# Altium project UKU20710_FACE_DWIN.PrjPCB
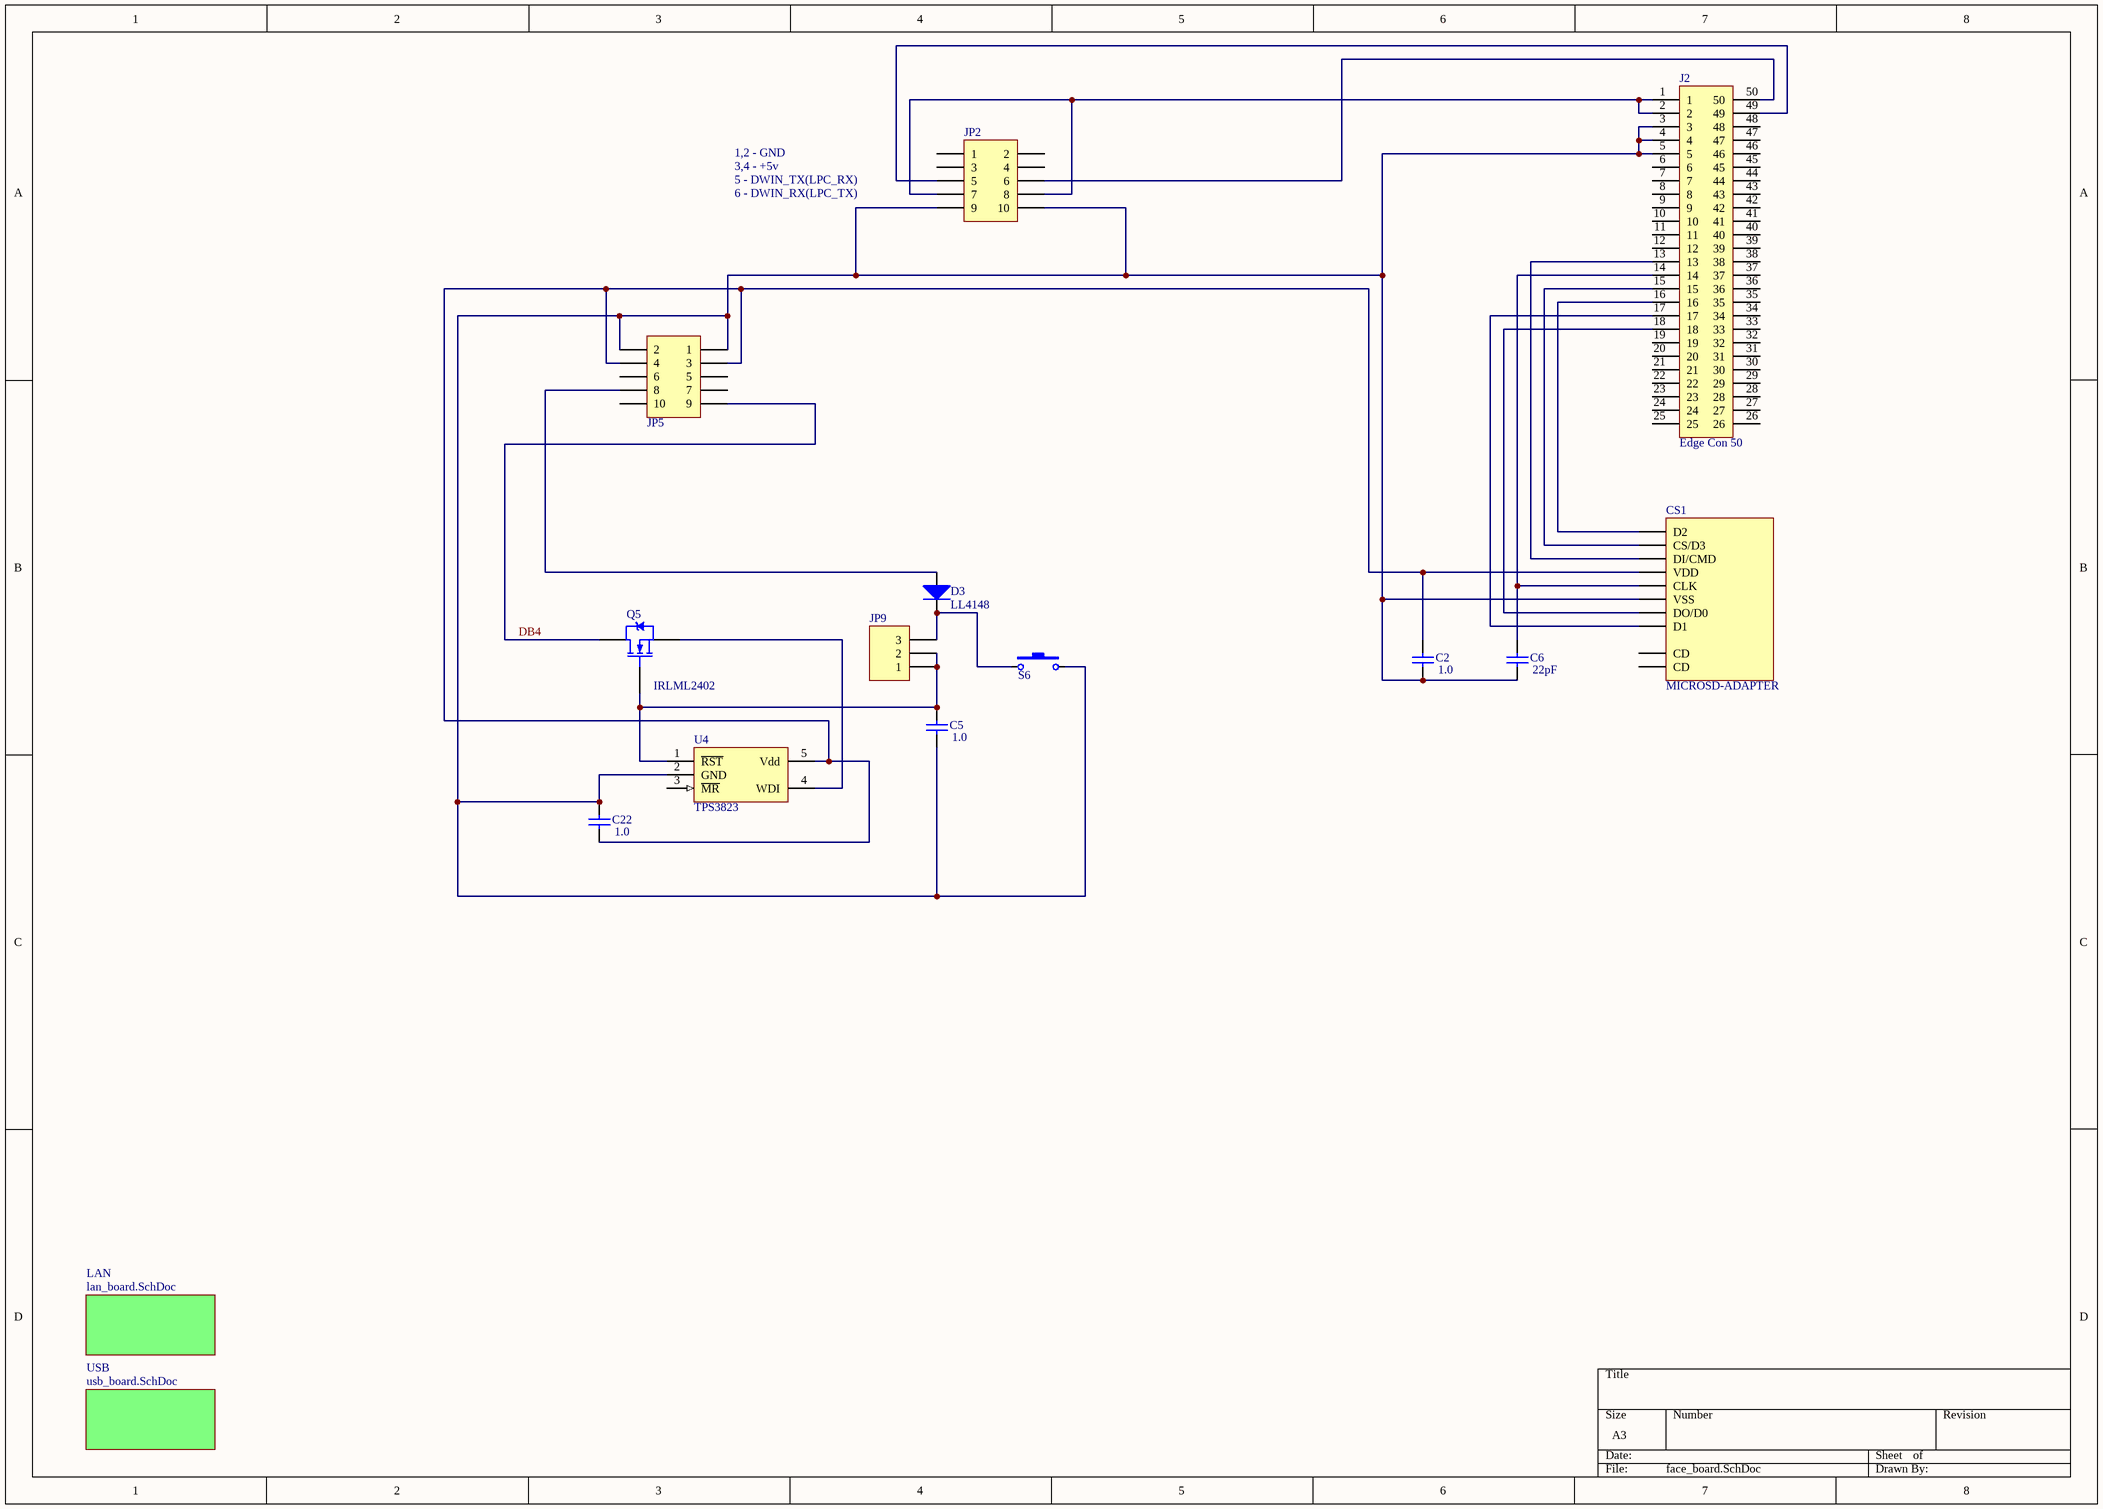
[diagram p0: face_board.SchDoc]
3 sheets, 59 parts. Net scope: global (net labels, ports and power ports of the same name join across sheets).
Board file: uku20710_face.PcbDoc
Sheets:
  face_board.SchDoc
    USB = usb_board.SchDoc
    LAN = lan_board.SchDoc

## Sheet face_board.SchDoc
size A3

### Parts
C2  1.0  [_0603]
C5  1.0  [_0603]
C6  22pF  [_0603]
C22  1.0  [_0603]
CS1  MICROSD-ADAPTER  [microsd_2]
D3  LL4148  [_1206d]
J2  Edge Con 50  [FH12-50]
JP2  PBD-10  [HDR2X5]  (value not drawn)
JP5  PLHD-20  [HDR2X5]  (value not drawn)
JP9  PLS-3  [HDR1X3]  (value not drawn)
Q5  IRLML2402  [SO-G3]
S6  SWT-6  [SWT-6]  (value not drawn)
U4  TPS3823  [SO-G5/P.95]

### Sub-sheets
LAN = lan_board.SchDoc: no entries
USB = usb_board.SchDoc: no entries

### Nets
DB4: JP5.9 Q5.3(D)
NetC2_1: C2.1 C5.1 C6.1 C22.2 CS1.6(VSS) J2.3 J2.4 J2.5 JP2.9 JP2.10 JP5.1 JP5.2 S6.2 U4.2(GND)
NetC2_2: C2.2 C22.1 CS1.4(VDD) JP5.3 JP5.4 U4.5(Vdd)
NetC5_2: C5.2 JP9.1 JP9.2 Q5.1(G) U4.1(~{RST})
NetC6_2: C6.2 CS1.5(CLK) J2.14
NetCS1_1: CS1.1(D2) J2.16
NetCS1_2: CS1.2(CS/D3) J2.15
NetCS1_3: CS1.3(DI/CMD) J2.13
NetCS1_7: CS1.7(DO/D0) J2.18
NetCS1_8: CS1.8(D1) J2.17
NetD3_1: D3.1(A) JP5.8
NetD3_2: D3.2(K) JP9.3 S6.1
NetJ2_1: J2.1 J2.2 JP2.7 JP2.8
NetJ2_49: J2.49 JP2.5
NetJ2_50: J2.50 JP2.6
NetQ5_2: Q5.2(S) U4.4(WDI)

Not connected (* = marked no-connect by the designer): CS1 9(CD) 10(CD); J2 6 7 8 9 10 11 12 19 20 21 22 23 24 25 26 27 28 29 30 31 32 33 34 35 36 37 38 39 40 41 42 43 44 45 46 47 48; JP2 1 2 3 4; JP5 5 6 7 10; U4 3(~{MR})

### Notes on the sheet
- 1,2 - GND
- 3,4 - +5v
- 5 - DWIN_TX(LPC_RX)
- 6 - DWIN_RX(LPC_TX)

### Library data of the parts
C2 C5 C22 = Cap Semi: Capacitor; Manufacturer: Generic Components; Class I: Passive; Value: 0,1; Published: 8-Jun-2000; Revision: July-2002: Re-released for DXP Platform.; Publisher: Altium Limited; Class II: Capacitor
C6 = Cap Semi: Capacitor; Manufacturer: Generic Components; Class I: Passive; Published: 8-Jun-2000; Revision: July-2002: Re-released for DXP Platform.; Publisher: Altium Limited; Class II: Capacitor; Value: 22pF
D3 = Diode: Manufacturer: Generic Components; Class I: Discrete; Class II: Diode - Switching; Published: 8-Jun-2000; Revision: July-2002: Re-released for DXP Platform.; Publisher: Altium Limited; Value: LL4148
J2 = Edge Con 50: 50-Pin Edge Connector; Manufacturer: Generic Components; Revision: July-2002: Re-released for DXP Platform.; Publisher: Altium Limited; Class I: Connector
JP2 JP5 = Header 5X2: Header, 5-Pin, Dual row; Manufacturer: Generic Components; Class I: Connector; Revision: July-2002: Re-released for DXP Platform.; Publisher: Altium Limited
JP9 = Header 3: Header, 3-Pin; Manufacturer: Generic Components; Class I: Connector; Revision: July-2002: Re-released for DXP Platform.; Publisher: Altium Limited
Q5 = IRLML2402: HEXFET Power MOSFET; Manufacturer: International Rectifier; Class I: Discrete; Class II: MOSFET - Power; Published: 8-Jun-2000; Revision: July-2002: Re-released for DXP Platform.; Datasheet: Latest Revision: Aug-1997; Package Reference: SOT-23; Publisher: Altium Limited; Value: IRLML2402
S6 = SWT-9: Button; Manufacturer: Generic Components; Published: 24-Mar-1999; Revision: July-2002: Re-released for DXP Platform.; Publisher: Altium Limited; Value: SWT-6
U4 = TPS3823: Reset IC; Manufacturer: National Semiconductor; Package Information: Latest Revision: Aug-1999; Class I: Power Management; Class II: Voltage Regulator; Value: TPS76333; Published: 15-Apr-2002; Datasheet: Latest Revision: Oct-1999; Package Reference: MA05B; Publisher: Altium Limited

## Sheet usb_board.SchDoc
size A4
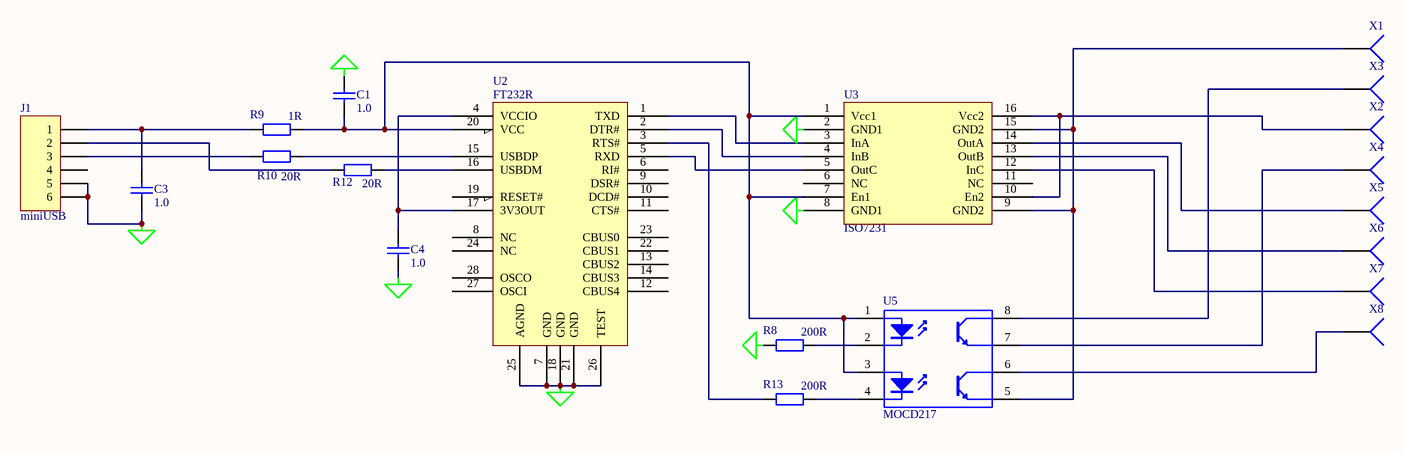
[diagram p1: usb_board.SchDoc]

### Parts
C1  1.0  [_0603]
C3  1.0  [_0603]
C4  1.0  [_0603]
J1  miniUSB  [USBmini]
R8  200R  [_0603]
R9  1R  [_0603]
R10  20R  [_0603]
R12  20R  [_0603]
R13  200R  [_0603]
U2  FT232R  [SOP65P780-28L]
U3  ISO7231
U5  MOCD217  [SO-G8]
X1  (no value)  [PIN1]
X2  (no value)  [PIN1]
X3  (no value)  [PIN1]
X4  (no value)  [PIN1]
X5  (no value)  [PIN1]
X6  (no value)  [PIN1]
X7  (no value)  [PIN1]
X8  (no value)  [PIN1]

### Nets
GND_USB: C1.1 C3.1 C4.1 J1.5 J1.6 R8.1 U2.7(GND) U2.18(GND) U2.21(GND) U2.25(AGND) U2.26(TEST) U3.2(GND1) U3.8(GND1)
NetC1_2: C1.2 R9.2 U2.20(VCC) U3.1(Vcc1) U3.7(En1) U5.1(A) U5.3(A)
NetC3_2: C3.2 J1.1 R9.1
NetC4_2: C4.2 U2.4(VCCIO) U2.17(3V3OUT)
NetJ1_2: J1.2 R12.1
NetJ1_3: J1.3 R10.1
NetR8_2: R8.2 U5.2(K)
NetR10_2: R10.2 U2.15(USBDP)
NetR12_2: R12.2 U2.16(USBDM)
NetR13_1: R13.1 U2.3(RTS#)
NetR13_2: R13.2 U5.4(K)
NetU2_1: U2.1(TXD) U3.3(InA)
NetU2_2: U2.2(DTR#) U3.4(InB)
NetU2_5: U2.5(RXD) U3.5(OutC)
NetU3_9: U3.9(GND2) U3.15(GND2) U5.5(E) X1.1
NetU3_10: U3.10(En2) U3.16(Vcc2) X2.1
NetU3_12: U3.12(InC) X7.1
NetU3_13: U3.13(OutB) X6.1
NetU3_14: U3.14(OutA) X5.1
NetU5_6: U5.6(C) X8.1
NetU5_7: U5.7(E) X4.1
NetU5_8: U5.8(C) X3.1

Not connected (* = marked no-connect by the designer): J1 4; U2 6(RI#) 8(NC) 9(DSR#) 10(DCD#) 11(CTS#) 12(CBUS4) 13(CBUS2) 14(CBUS3) 19(RESET#) 22(CBUS1) 23(CBUS0) 24(NC) 27(OSCI) 28(OSCO); U3 6(NC) 11(NC)

### Library data of the parts
C1 C3 C4 = Cap Semi: Capacitor (Semiconductor SIM Model); Manufacturer: Generic Components; Class I: Passive; Value: 1,0; Published: 8-Jun-2000; Revision: July-2002: Re-released for DXP Platform.; Publisher: Altium Limited; Class II: Capacitor
J1 = Header 6: Header, 6-Pin; Value: USB-B; LatestRevisionDate: 17-Jul-2002; LatestRevisionNote: Re-released for DXP Platform.; Publisher: Altium Limited
R8-R10 R12 R13 = RES: Body: 0603; Value: 22R; Type: S; Pins: 2
U2 = FT232R: Body: SSOP28LD; Value: FT232RL; Type: S; Pins: 20
U5 = MOCD217: Optic; Value: MOCD217
X1-X8 = Socket: Manufacturer: Generic Components; Class I: Connector; Revision: July-2002: Re-released for DXP Platform.; Publisher: Altium Limited

## Sheet lan_board.SchDoc
size A4
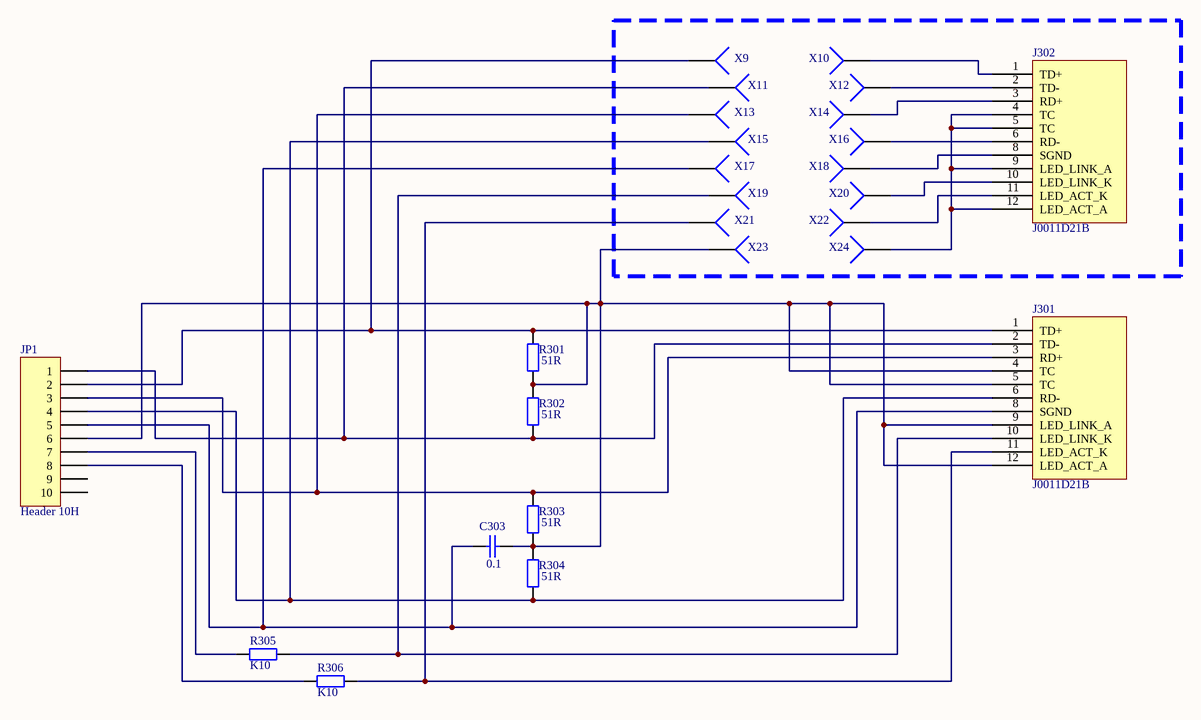
[diagram p2: lan_board.SchDoc]

### Parts
C303  0.1  [_0603]
J301  J0011D21B  [J0011D21B]
J302  J0011D21B  [J0011D21B]
JP1  Header 10H  [HDR2X5]
R301  51R  [_0603]
R302  51R  [_0603]
R303  51R  [_0603]
R304  51R  [_0603]
R305  K10  [_0603]
R306  K10  [_0603]
X9  (no value)  [PIN1]
X10  (no value)  [PIN1]
X11  (no value)  [PIN1]
X12  (no value)  [PIN1]
X13  (no value)  [PIN1]
X14  (no value)  [PIN1]
X15  (no value)  [PIN1]
X16  (no value)  [PIN1]
X17  (no value)  [PIN1]
X18  (no value)  [PIN1]
X19  (no value)  [PIN1]
X20  (no value)  [PIN1]
X21  (no value)  [PIN1]
X22  (no value)  [PIN1]
X23  (no value)  [PIN1]
X24  (no value)  [PIN1]

### Nets
NetC303_1: C303.1 J301.8(SGND) JP1.5 X17.1
NetC303_2: C303.2 J301.4(TC) J301.5(TC) J301.9(LED_LINK_A) J301.12(LED_ACT_A) JP1.6 R301.2 R302.1 R303.2 R304.1 X23.1
NetJ301_1: J301.1(TD+) JP1.2 R301.1 X9.1
NetJ301_2: J301.2(TD-) JP1.1 R302.2 X11.1
NetJ301_3: J301.3(RD+) JP1.3 R303.1 X13.1
NetJ301_6: J301.6(RD-) JP1.4 R304.2 X15.1
NetJ301_10: J301.10(LED_LINK_K) R305.1 X19.1
NetJ301_11: J301.11(LED_ACT_K) R306.1 X21.1
NetJ302_1: J302.1(TD+) X10.1
NetJ302_2: J302.2(TD-) X12.1
NetJ302_3: J302.3(RD+) X14.1
NetJ302_4: J302.4(TC) J302.5(TC) J302.9(LED_LINK_A) J302.12(LED_ACT_A) X24.1
NetJ302_6: J302.6(RD-) X16.1
NetJ302_8: J302.8(SGND) X18.1
NetJ302_10: J302.10(LED_LINK_K) X20.1
NetJ302_11: J302.11(LED_ACT_K) X22.1
NetJP1_7: JP1.7 R305.2
NetJP1_8: JP1.8 R306.2

Not connected (* = marked no-connect by the designer): JP1 9 10

### Library data of the parts
C303 = Cap Semi: as C1 on sheet usb_board; Published: 8-Jun-2000; Revision: July-2002: Re-released for DXP Platform.; Publisher: Altium Limited; Class II: Capacitor
JP1 = Header 10H: Header, 10-Pin, Right Angle; Manufacturer: Generic Components; Class I: Connector; Revision: July-2002: Re-released for DXP Platform.; Publisher: Altium Limited
R301-R306 = Res2: Resistor; Manufacturer: Generic Components; Class I: Passive; Value: 30; Rule: Undefined; Published: 8-Jun-2000; Revision: July-2002: Re-released for DXP Platform.; Publisher: Altium Limited; Class II: Resistor
X9-X24 = Socket: as X1 on sheet usb_board; Revision: July-2002: Re-released for DXP Platform.; Publisher: Altium Limited